# EAGLE design 2_Out_Headphone_Amp (EAGLE 6.6.0)
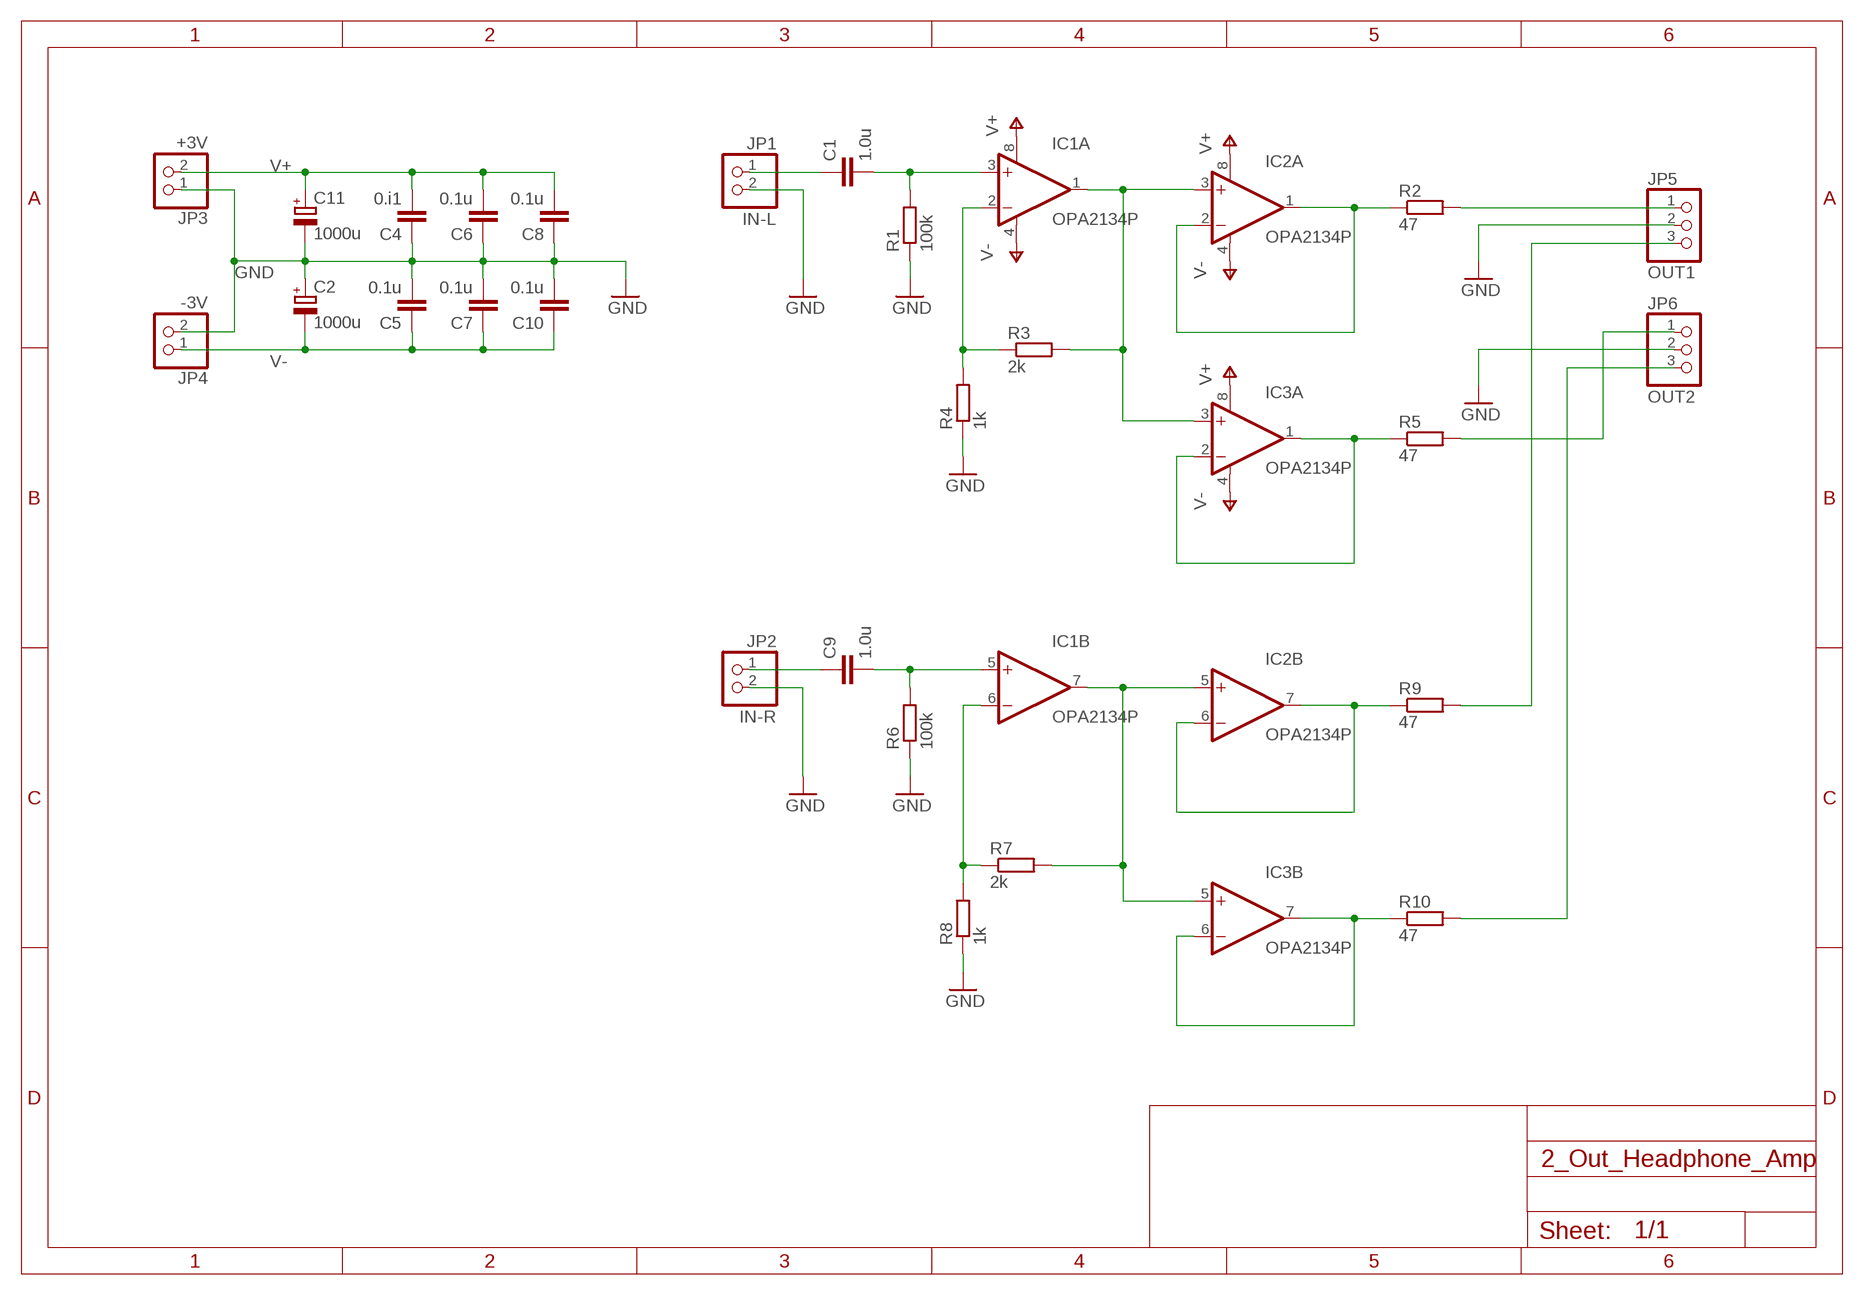
[diagram p0: schematic, sheet 1]

## Parts
C1  1.0u  C-EU050-045X075  [C050-045X075]
C2  1000u  CPOL-EUTT5D11L  [TT5D11L]
C4  0.i1  C-EU050-024X044  [C050-024X044]
C5  0.1u  C-EU050-024X044  [C050-024X044]
C6  0.1u  C-EU050-024X044  [C050-024X044]
C7  0.1u  C-EU050-024X044  [C050-024X044]
C8  0.1u  C-EU050-024X044  [C050-024X044]
C9  1.0u  C-EU050-045X075  [C050-045X075]
C10  0.1u  C-EU050-024X044  [C050-024X044]
C11  1000u  CPOL-EUTT5D11L  [TT5D11L]
IC1  OPA2134P  [DIL08]
IC2  OPA2134P  [DIL08]
IC3  OPA2134P  [DIL08]
JP1  IN-L  PINHD-1X2  [1X02]
JP2  IN-R  PINHD-1X2  [1X02]
JP3  +3V  PINHD-1X2  [1X02]
JP4  -3V  PINHD-1X2  [1X02]
JP5  OUT1  PINHD-1X3  [1X03]
JP6  OUT2  PINHD-1X3  [1X03]
R1  100k  R-EU_0207/2V  [0207/2V]
R2  47  R-EU_0207/7  [0207/7]
R3  2k  R-EU_0207/7  [0207/7]
R4  1k  R-EU_0207/2V  [0207/2V]
R5  47  R-EU_0207/7  [0207/7]
R6  100k  R-EU_0207/2V  [0207/2V]
R7  2k  R-EU_0207/2V  [0207/2V]
R8  1k  R-EU_0207/2V  [0207/2V]
R9  47  R-EU_0207/7  [0207/7]
R10  47  R-EU_0207/7  [0207/7]

## Nets
GND: C2.+ C4.1 C5.2 C6.1 C7.2 C8.1 C10.2 C11.- JP1.2 JP2.2 JP3.1 JP4.2 JP5.2 JP6.2 R1.1 R4.1 R6.1 R8.1
N$1: C1.1 JP1.1
N$2: C1.2 IC1.3(A:+IN) R1.2
N$3: IC1.2(A:-IN) R3.1 R4.2
N$4: IC1.1(A:OUT) IC2.3(A:+IN) IC3.3(A:+IN) R3.2
N$5: IC2.1(A:OUT) IC2.2(A:-IN) R2.1
N$6: JP5.1 R2.2
N$7: IC3.1(A:OUT) IC3.2(A:-IN) R5.1
N$8: JP6.1 R5.2
N$9: C9.1 JP2.1
N$10: C9.2 IC1.5(B:+IN) R6.2
N$11: IC1.6(B:-IN) R7.1 R8.2
N$12: IC1.7(B:OUT) IC2.5(B:+IN) IC3.5(B:+IN) R7.2
N$13: IC2.6(B:-IN) IC2.7(B:OUT) R9.1
N$14: IC3.6(B:-IN) IC3.7(B:OUT) R10.1
N$15: JP5.3 R9.2
N$16: JP6.3 R10.2
V+: C4.2 C6.2 C8.2 C11.+ IC1.8(A:V+) IC2.8(A:V+) IC3.8(A:V+) JP3.2
V-: C2.- C5.1 C7.1 C10.1 IC1.4(A:V-) IC2.4(A:V-) IC3.4(A:V-) JP4.1

## Library data of the parts
C1 C4-C10 = rcl:C-EU: CAPACITOR, European symbol
C2 C11 = rcl:CPOL-EU: POLARIZED CAPACITOR, European symbol
IC1-IC3 = burr-brown:OPA2134: Operational Amplifier; MF: TEXAS INSTRUMENTS; MPN: OPA2134PA; OC_FARNELL: 1097574; OC_NEWARK: 74K3897
JP1-JP4 = pinhead:PINHD-1X2: PIN HEADER
JP5 JP6 = pinhead:PINHD-1X3: PIN HEADER
R1-R10 = rcl:R-EU_: RESISTOR, European symbol

## Board
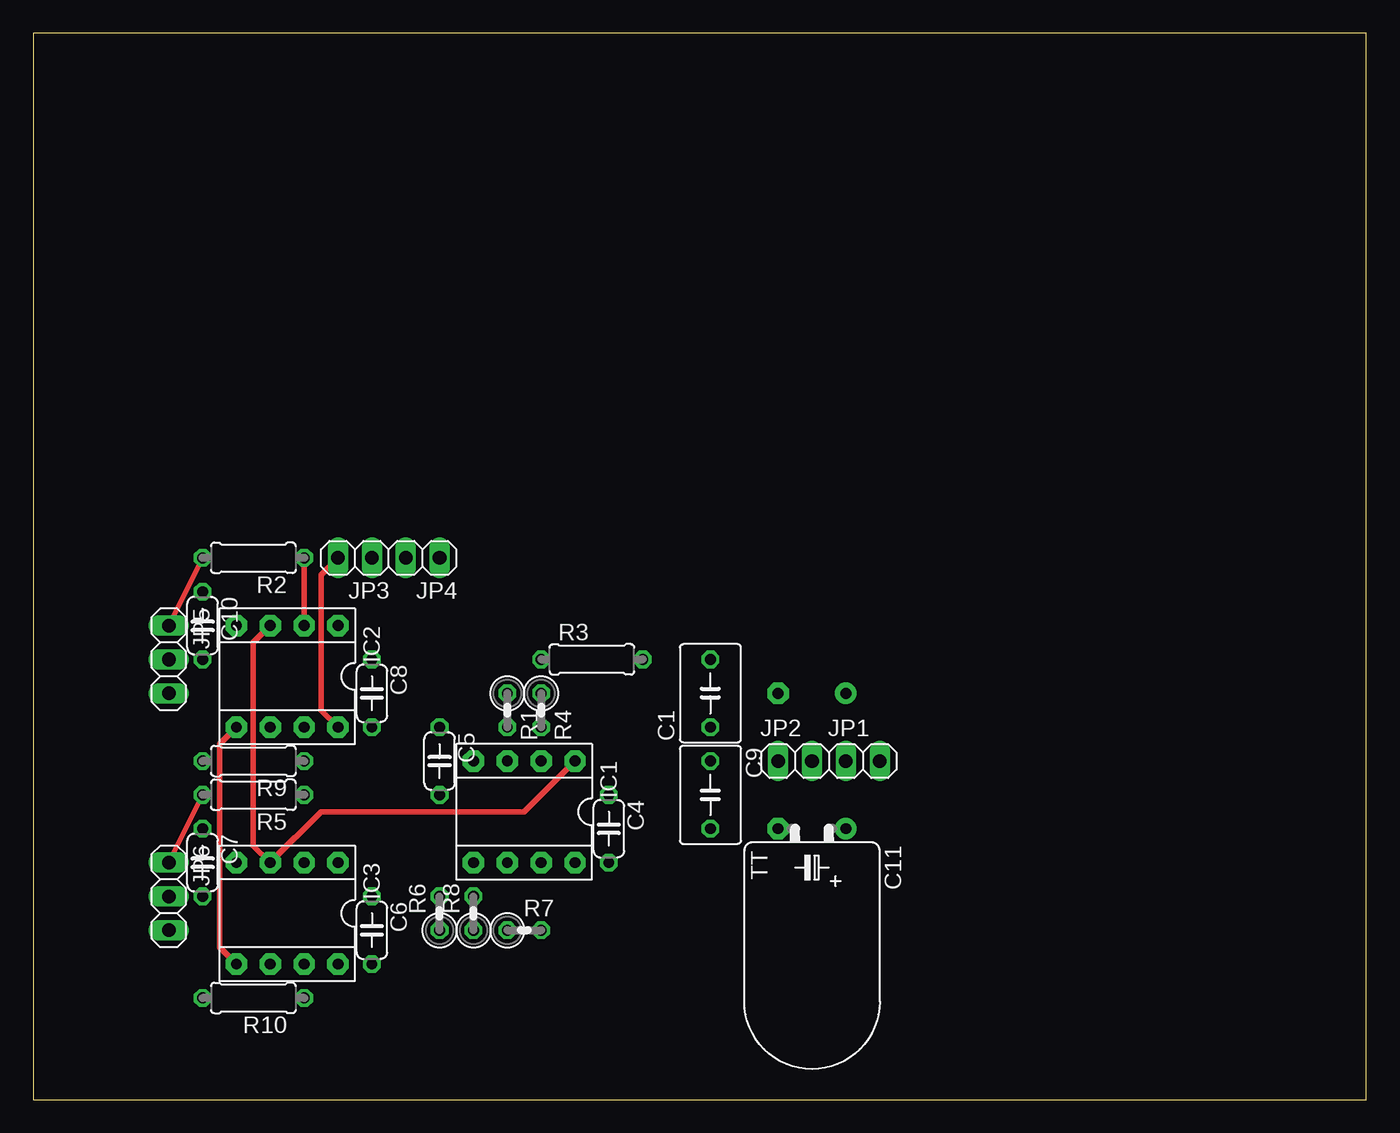
[diagram p1: board, top side]
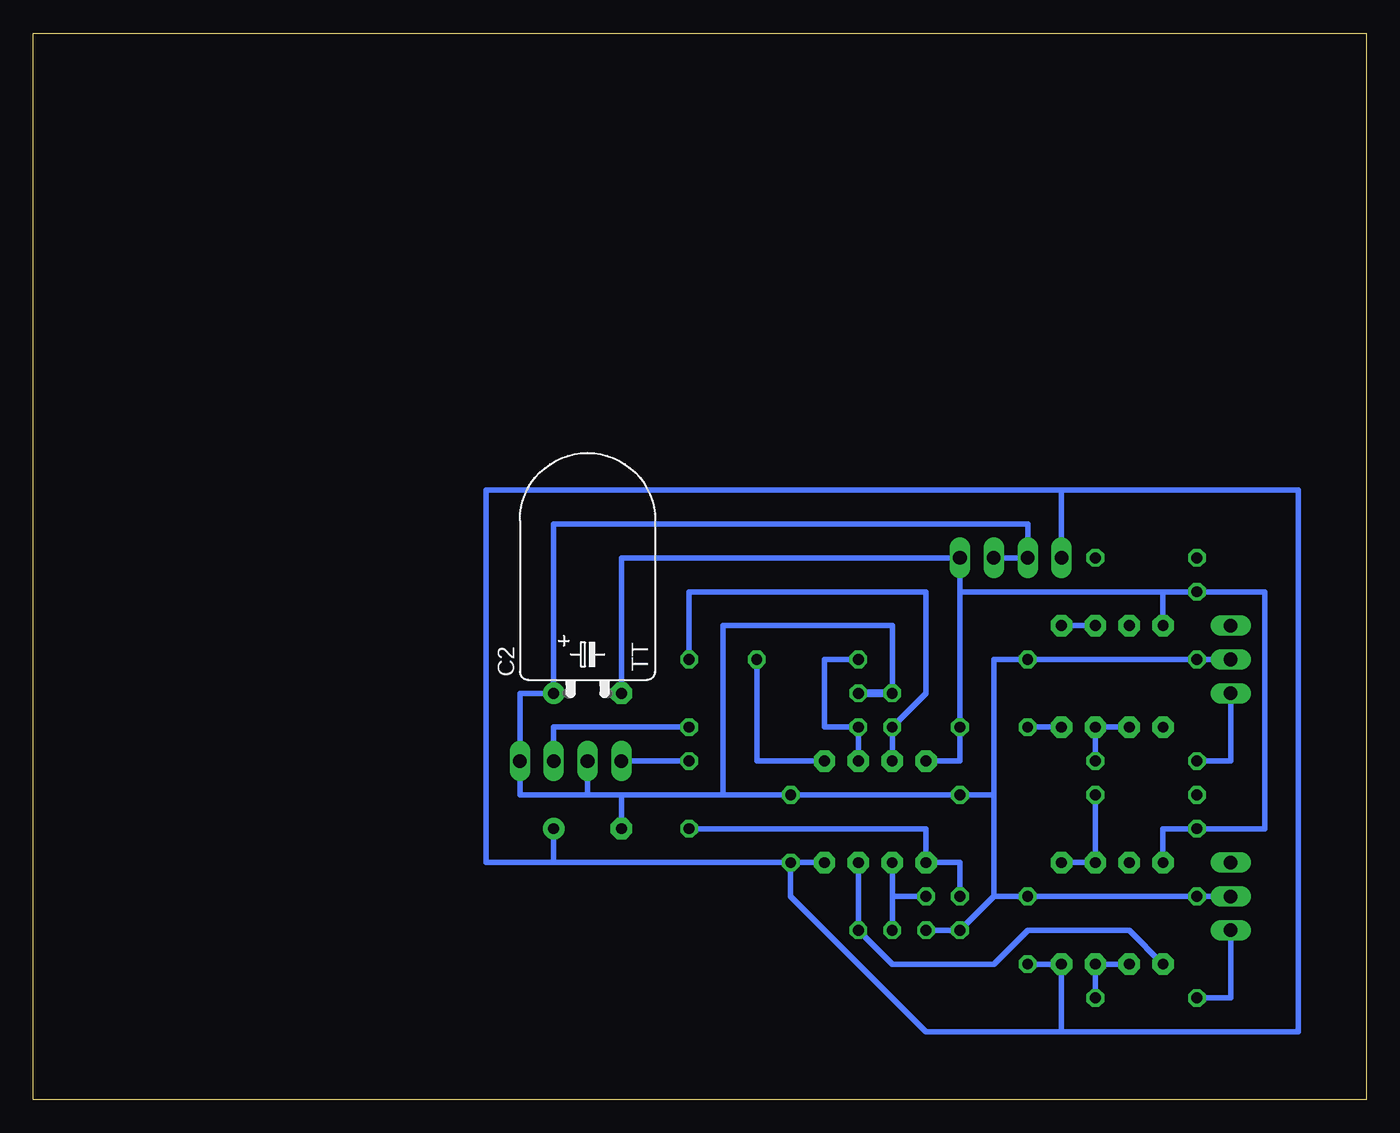
[diagram p2: board, bottom side, seen from below]

Size 100 x 80 mm. Coordinates in mm from the lower left corner, seen from the top.
Outline: 0,0 100,0 100,80 0,80 0,0
Copper layers (1*16): Top 0.035mm / dielectric 1.5mm / Bottom 0.035mm
Design rules "default": minimum track width 10mil, minimum drill 24mil, track to track 8mil, track to pad 8mil, pad to pad 8mil, via to via 8mil, smd to smd 8mil, copper to edge 40mil, drill to drill 8mil, minimum pad ring 10mil, minimum via ring 8mil, stop-mask expansion 4mil, vias tented up to drill 0mil, thermal gap 10mil

### Footprints (pad centres in the part's own frame; a part is rotated, then mirrored left to right if it is on the bottom)
C050-045X075 = drill 0.813 octagon: 1 -2.54,0; 2 2.54,0
TT5D11L = drill 0.813 pad 1.6: + -2.54,0 | drill 0.813 pad 1.6 octagon: - 2.54,0
C050-024X044 = drill 0.813 octagon: 1 -2.54,0; 2 2.54,0
DIL08 = drill 0.813 pad 1.6 octagon: 1 -3.81,-3.81; 2 -1.27,-3.81; 3 1.27,-3.81; 4 3.81,-3.81; 5 3.81,3.81; 6 1.27,3.81; 7 -1.27,3.81; 8 -3.81,3.81
1X02 = drill 1.016 long: 1 -1.27,0; 2 1.27,0
1X03 = drill 1.016 long: 1 -2.54,0; 2 0,0; 3 2.54,0
0207/2V = drill 0.813 octagon: 1 -1.27,0; 2 1.27,0
0207/7 = drill 0.813 octagon: 1 -3.81,0; 2 3.81,0

### Placement (x,y rotation side)
C1  50.8,30.48 90 top
C2  58.42,30.48 0 bottom
C4  43.18,20.32 270 top
C5  30.48,25.4 270 top
C6  25.4,12.7 270 top
C7  12.7,17.78 270 top
C8  25.4,30.48 270 top
C9  50.8,22.86 270 top
C10  12.7,35.56 270 top
C11  58.42,20.32 180 top
IC1  36.83,21.59 180 top
IC2  19.05,31.75 180 top
IC3  19.05,13.97 180 top
JP1  62.23,25.4 0 top
JP2  57.15,25.4 0 top
JP3  24.13,40.64 180 top
JP4  29.21,40.64 180 top
JP5  10.16,33.02 270 top
JP6  10.16,15.24 270 top
R1  35.56,29.21 270 top
R2  16.51,40.64 180 top
R3  41.91,33.02 0 top
R4  38.1,29.21 270 top
R5  16.51,22.86 180 top
R6  30.48,13.97 90 top
R7  36.83,12.7 0 top
R8  33.02,13.97 90 top
R9  16.51,25.4 180 top
R10  16.51,7.62 180 top

### Tracks (layer width: path | path; a pad name or v marks a point on that pad's centre or on a via)
GND
  Bottom 0.406: JP5.2 C10.2 C8.1 27.94,33.02 27.94,22.86 | JP6.2 C7.2 C6.1 27.94,15.24 | 27.94,22.86 C5.2 C4.1 48.26,22.86 | JP4.2 JP3.1 25.4,43.18 60.96,43.18 C2.+ 63.5,30.48 JP1.2 63.5,22.86 58.42,22.86 | 27.94,15.24 27.94,22.86 | R8.1 R6.1 27.94,15.24 | 48.26,22.86 55.88,22.86 | 55.88,22.86 58.42,22.86 | JP2.2 58.42,22.86 | R1.1 35.56,35.56 48.26,35.56 48.26,22.86 | C11.- 55.88,22.86
  Bottom 0.61: R1.1 R4.1
N$1
  Bottom 0.406: JP1.1 60.96,27.94 C1.1
N$2
  Bottom 0.406: IC1.3 R1.2 33.02,30.48 33.02,38.1 50.8,38.1 C1.2
N$3
  Bottom 0.406: IC1.2 R4.2 40.64,27.94 40.64,33.02 R3.1
N$4
  Top 0.406: IC2.3 16.51,34.29 16.51,19.05 IC3.3 21.59,21.59 36.83,21.59 IC1.1
  Bottom 0.406: R3.2 45.72,25.4 IC1.1
N$5
  Top 0.406: IC2.2 R2.1
  Bottom 0.406: IC2.2 IC2.1
N$6
  Top 0.406: R2.2 JP5.1
N$7
  Bottom 0.406: IC3.1 IC3.2 R5.1
N$8
  Top 0.406: JP6.1 R5.2
N$9
  Bottom 0.406: C9.1 JP2.1
N$10
  Bottom 0.406: R6.2 30.48,17.78 IC1.5 33.02,20.32 C9.2
N$11
  Bottom 0.406: 35.56,15.24 R8.2 | IC1.6 35.56,15.24 | R7.1 35.56,15.24
N$12
  Top 0.406: IC2.5 13.97,26.67 13.97,11.43 IC3.5
  Bottom 0.406: IC1.7 R7.2 35.56,10.16 27.94,10.16 25.4,12.7 17.78,12.7 IC3.5
N$13
  Bottom 0.406: IC2.6 IC2.7 R9.1
N$14
  Bottom 0.406: IC3.6 IC3.7 R10.1
N$15
  Bottom 0.406: JP5.3 10.16,25.4 R9.2
N$16
  Bottom 0.406: JP6.3 10.16,7.62 R10.2
V+
  Top 0.406: JP3.2 21.59,39.37 21.59,29.21 IC2.8
  Bottom 0.406: C8.2 IC2.8 | 22.86,45.72 5.08,45.72 5.08,5.08 22.86,5.08 | 60.96,17.78 66.04,17.78 66.04,45.72 22.86,45.72 | 60.96,17.78 C4.2 | JP3.2 22.86,45.72 | IC1.8 C4.2 | C11.+ 60.96,17.78 | C6.2 IC3.8 22.86,5.08 | C4.2 43.18,15.24 33.02,5.08 22.86,5.08
V-
  Bottom 0.406: 30.48,38.1 JP4.1 55.88,40.64 C2.- | 30.48,38.1 C5.1 30.48,25.4 IC1.4 | IC2.4 15.24,38.1 | 15.24,38.1 30.48,38.1 | 15.24,38.1 C10.1 7.62,38.1 7.62,20.32 C7.1 15.24,20.32 IC3.4